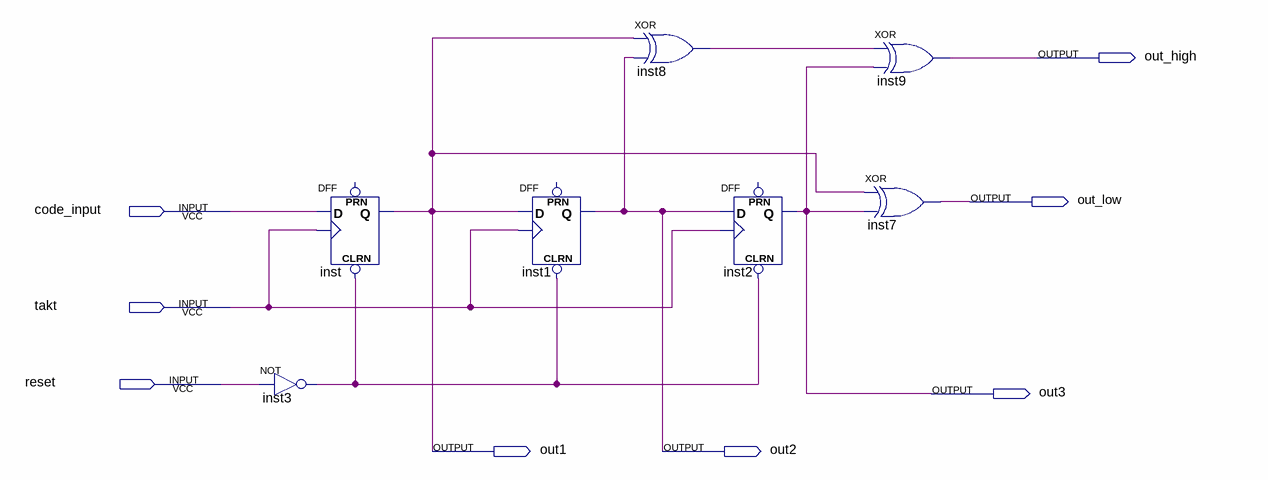
[diagram p0: schematic sheet]
// Quartus schematic Faltungscodierer.bdf as structural Verilog: 7 symbols, 8 pins
module Faltungscodierer (
  input  code_input,
  input  takt,
  input  reset,
  output out_high,
  output out_low,
  output out3,
  output out1,
  output out2
);

  wire inst3_out, inst8_out;

  not inst3 (inst3_out, reset);
  DFF inst (.CLRN(inst3_out), .CLK(takt), .D(code_input), .Q(out1));  // open: PRN
  DFF inst1 (.CLRN(inst3_out), .CLK(takt), .D(out1), .Q(out2));  // open: PRN
  xor inst8 (inst8_out, out1, out2);
  DFF inst2 (.CLRN(inst3_out), .CLK(takt), .D(out2), .Q(out3));  // open: PRN
  xor inst9 (out_high, inst8_out, out3);
  xor inst7 (out_low, out1, out3);
endmodule
